# EAGLE design test1 (EAGLE 7.3.0)
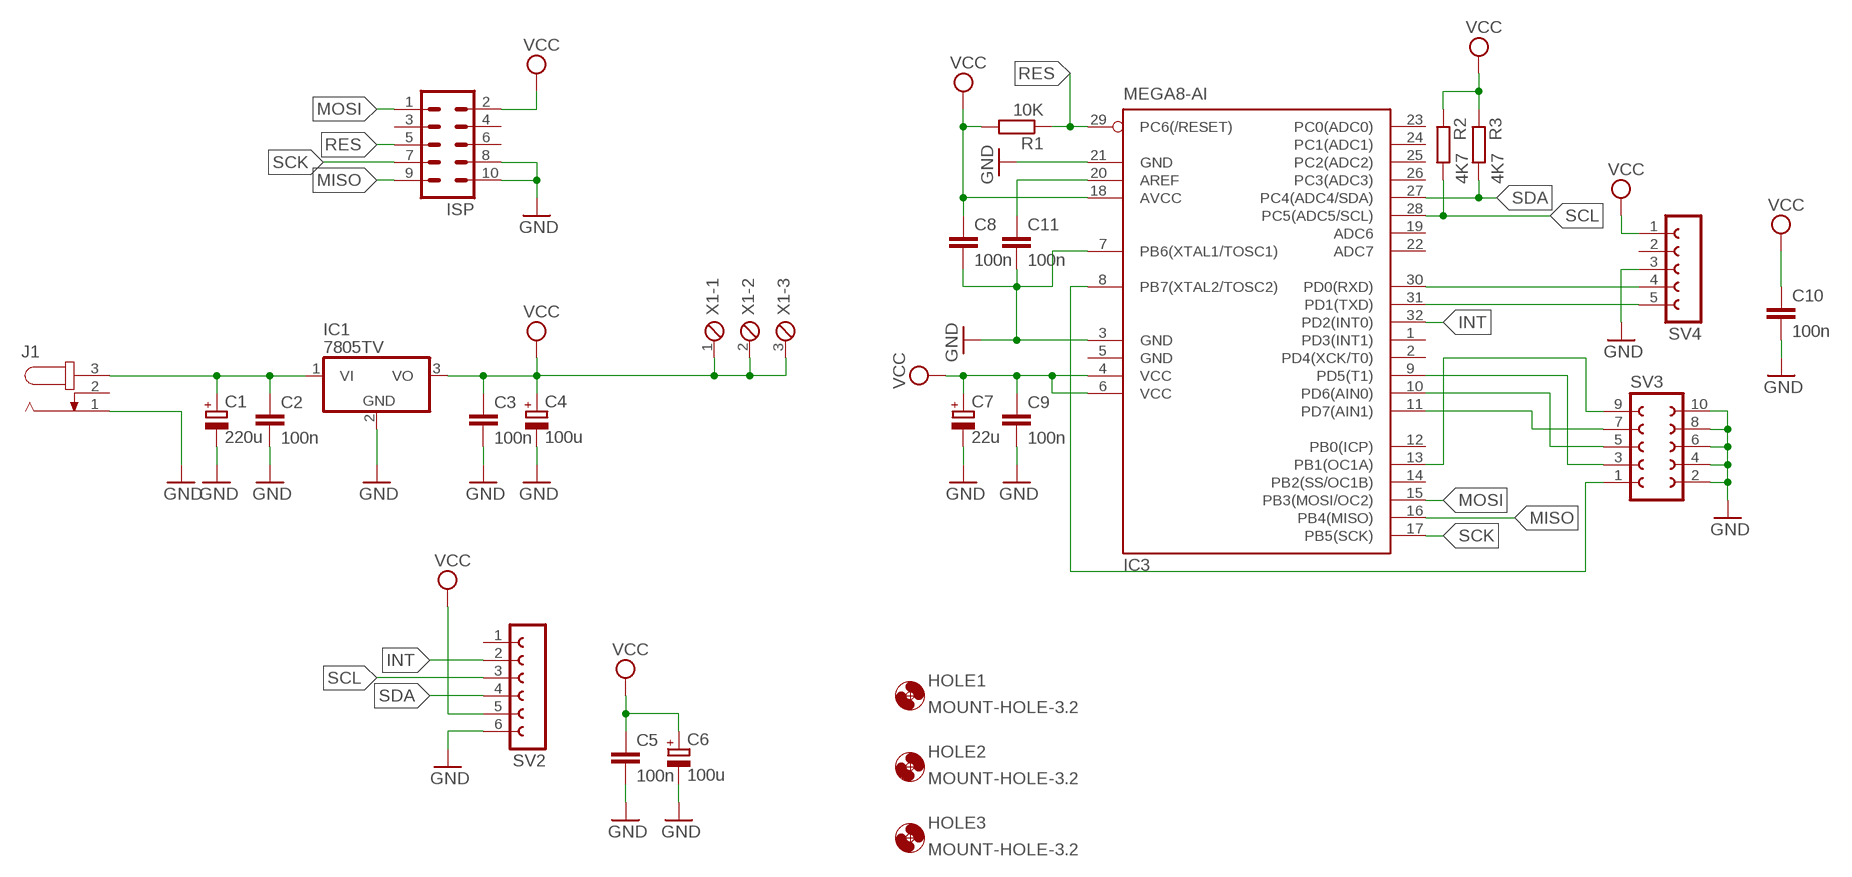
[diagram p0: schematic, sheet 1]

## Parts
C1  220u  CPOL-EUE3.5-8  [E3,5-8]
C2  100n  C-EUC0805  [C0805]
C3  100n  C-EUC0805  [C0805]
C4  100u  CPOL-EUE2.5-5  [E2,5-5]
C5  100n  C-EUC0805  [C0805]
C6  100u  CPOL-EUE2.5-5  [E2,5-5]
C7  22u  CPOL-EUE2.5-5  [E2,5-5]
C8  100n  C-EUC0805  [C0805]
C9  100n  C-EUC0805  [C0805]
C10  100n  C-EUC0805  [C0805]
C11  100n  C-EUC0805  [C0805]
HOLE1  MOUNT-HOLE-3.2  [3,2]
HOLE2  MOUNT-HOLE-3.2  [3,2]
HOLE3  MOUNT-HOLE-3.2  [3,2]
IC1  7805TV  [TO220V]
IC3  MEGA8-AI  [TQFP32-08]
ISP  ML10  [ML10]
J1  JACK-PLUG1  [SPC4078]
R1  10K  R-EU_R0805  [R0805]
R2  4K7  R-EU_R0805  [R0805]
R3  4K7  R-EU_R0805  [R0805]
SV2  FE06-1  [FE06]
SV3  FE05-2  [FE05-2]
SV4  FE05-1  [FE05-1]
X1  MPT3  [3POL254]

## Nets
GND: C1.- C2.2 C3.2 C4.- C5.2 C6.- C7.- C8.2 C9.2 C10.2 C11.2 IC1.2(GND) IC3.3(GND) IC3.7(PB6(XTAL1/TOSC1)) IC3.21(GND) ISP.8 ISP.10 J1.1 SV2.6 SV3.2 SV3.4 SV3.6 SV3.8 SV3.10 SV4.3
INT: IC3.32(PD2(INT0)) SV2.2
MISO: IC3.16(PB4(MISO)) ISP.9
MOSI: IC3.15(PB3(MOSI/OC2)) ISP.1
N$1: C1.+ C2.1 IC1.1(VI) J1.3
N$2: C11.1 IC3.20(AREF)
N$4: IC3.30(PD0(RXD)) SV4.4
N$5: IC3.31(PD1(TXD)) SV4.5
N$6: IC3.8(PB7(XTAL2/TOSC2)) SV3.1
N$8: IC3.13(PB1(OC1A)) SV3.9
N$9: IC3.11(PD7(AIN1)) SV3.7
N$10: IC3.10(PD6(AIN0)) SV3.5
N$11: IC3.9(PD5(T1)) SV3.3
RES: IC3.29(PC6(/RESET)) ISP.5 R1.1
SCK: IC3.17(PB5(SCK)) ISP.7
SCL: IC3.28(PC5(ADC5/SCL)) R2.2 SV2.3
SDA: IC3.27(PC4(ADC4/SDA)) R3.2 SV2.4
VCC: C3.1 C4.+ C5.1 C6.+ C7.+ C8.1 C9.1 C10.1 IC1.3(VO) IC3.4(VCC) IC3.6(VCC) IC3.18(AVCC) ISP.2 R1.2 R2.1 R3.1 SV2.5 SV4.1 X1.1 X1.2 X1.3
Unconnected: IC3.1(PD3(INT1)) IC3.2(PD4(XCK/T0)) IC3.12(PB0(ICP)) IC3.14(PB2(SS/OC1B)) IC3.19(ADC6) IC3.22(ADC7) IC3.23(PC0(ADC0)) IC3.24(PC1(ADC1)) IC3.25(PC2(ADC2)) IC3.26(PC3(ADC3)) ISP.3 ISP.4 ISP.6 J1.2 SV2.1 SV4.2

## Power pins joined to a net without a drawn wire
GND: IC3.5(GND)

## Library data of the parts
C1 C4 C6 C7 = rcl:CPOL-EU: POLARIZED CAPACITOR, European symbol
C2 C3 C5 C8-C11 = rcl:C-EU: CAPACITOR, European symbol
HOLE1-HOLE3 = holes:MOUNT-HOLE-: MOUNTING HOLE with drill center marker; BOM: EXCLUDE
IC1 = linear:78*: Positive VOLTAGE REGULATOR Source: http://cache.national.com/ds/LM/LM78L05.pdf http://www.fairchildsemi.com/ds/LM/LM7805.pdf
IC3 = atmel:MEGA8: MICROCONTROLLER 8 Kbytes FLASH, 1 kbytes SRAM, 512 bytes EEPROM, USART, 6-channel 10 bit ADC, 2-channel 8 bit ADC Pin compatible with Atmega48, ATMega88, ATMega168 Source: avr.lbr; MPN: ATMEGA8-16AU; OC_FARNELL: 9171371; OC_NEWARK: 73M8863
ISP = con-harting-ml:ML10: HARTING; OC_FARNELL: unknown; OC_NEWARK: unknown
J1 = con-jack:JACK-PLUG: DC POWER JACK Power Jack, DC, Right Angle, Through Hole, Rated 5A at 16VDC, PC Terminals Distributor: Farnell (www.Farnell.de) Drawing: 84N1161.pdf / 84N1162.pdf Manufacturer: SPC Technology (www.spctechnology.com) Type: SPC4077 / SPC 4078; OC_FARNELL: unknown; OC_NEWARK: unknown
R1-R3 = rcl:R-EU_: RESISTOR, European symbol
SV2 = con-lsta:FE06-1: FEMALE HEADER; OC_FARNELL: unknown; OC_NEWARK: unknown
SV3 = con-lsta:FE05-2: FEMALE HEADER; OC_FARNELL: unknown; OC_NEWARK: unknown
SV4 = con-lsta:FE05-1: FEMALE HEADER; OC_FARNELL: unknown; OC_NEWARK: unknown
X1 = con-phoenix-254:MPT3: PHOENIX CONNECTOR; OC_FARNELL: unknown; OC_NEWARK: unknown

## Board
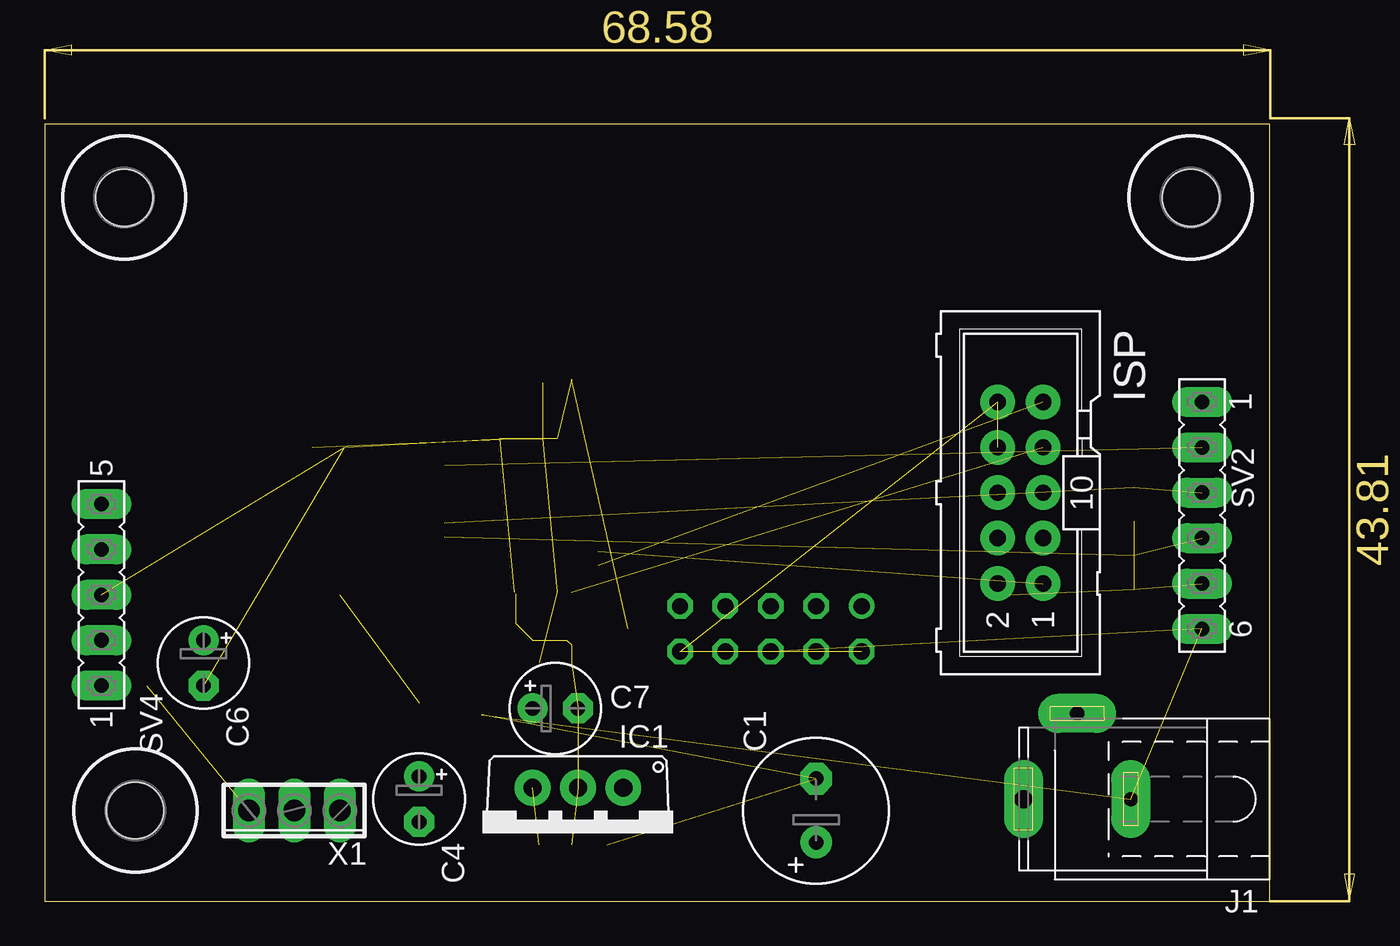
[diagram p1: board, top side]
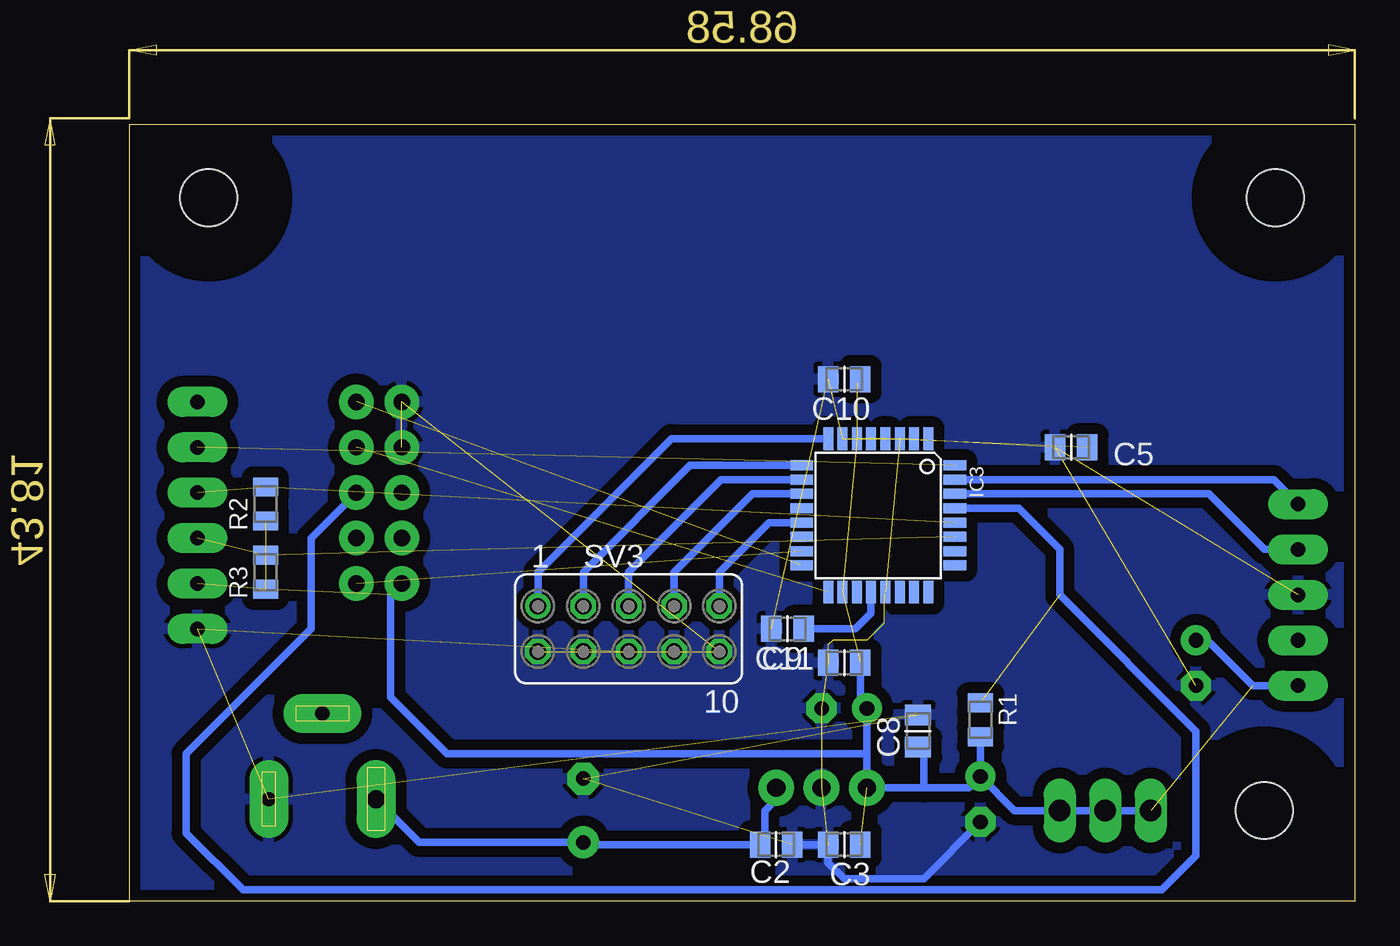
[diagram p2: board, bottom side, seen from below]

Size 68.56 x 43.48 mm. Coordinates in mm from the lower left corner, seen from the top.
Outline: 0,0 68.56,0 68.56,43.48 0,43.48 0,0
Copper layers (1*16): Top 0.035mm / dielectric 1.5mm / Bottom 0.035mm
Design rules "default *": minimum track width 10mil, minimum drill 24mil, track to track 8mil, track to pad 8mil, pad to pad 8mil, via to via 8mil, smd to smd 8mil, copper to edge 4mil, drill to drill 8mil, minimum pad ring 10mil, minimum via ring 8mil, stop-mask expansion 4mil, vias tented up to drill 0mil, thermal gap 10mil

### Footprints (pad centres in the part's own frame; a part is rotated, then mirrored left to right if it is on the bottom)
E3,5-8 = drill 0.813 pad 1.778: + -1.778,0 | drill 0.813 pad 1.778 octagon: - 1.778,0
C0805 = smd 1.15 x 1.45: 1 -0.9,0; 2 0.9,0
E2,5-5 = drill 0.813 pad 1.676: + -1.27,0 | drill 0.813 pad 1.676 octagon: - 1.27,0
3,2 = hole 3.2: 0,0
TO220V = drill 1.016 pad 2: 1 -2.54,-2.54; 2 0,-2.54; 3 2.54,-2.54
TQFP32-08 = smd 1.27 x 0.559: 1 -4.293,2.8; 2 -4.293,2; 3 -4.293,1.2; 4 -4.293,0.4; 5 -4.293,-0.4; 6 -4.293,-1.2; 7 -4.293,-2; 8 -4.293,-2.8; 17 4.293,-2.8; 18 4.293,-2; 19 4.293,-1.2; 20 4.293,-0.4; 21 4.293,0.4; 22 4.293,1.2; 23 4.293,2; 24 4.293,2.8 | smd 0.559 x 1.27: 9 -2.8,-4.293; 10 -2,-4.293; 11 -1.2,-4.293; 12 -0.4,-4.293; 13 0.4,-4.293; 14 1.2,-4.293; 15 2,-4.293; 16 2.8,-4.293; 25 2.8,4.293; 26 2,4.293; 27 1.2,4.293; 28 0.4,4.293; 29 -0.4,4.293; 30 -1.2,4.293; 31 -2,4.293; 32 -2.8,4.293
ML10 = drill 0.914 pad 1.93: 1 -5.08,-1.27; 2 -5.08,1.27; 3 -2.54,-1.27; 4 -2.54,1.27; 5 0,-1.27; 6 0,1.27; 7 2.54,-1.27; 8 2.54,1.27; 9 5.08,-1.27; 10 5.08,1.27
SPC4078 = drill 0.8 pad 2.184 long: 1 -3,0; 2 0,-4.8 | drill 1 pad 2.184 long: 3 3,0
R0805 = smd 1.05 x 1.4: 1 -0.95,0; 2 0.95,0
FE06 = drill 0.813 pad 1.676 long: 1 -6.35,0; 2 -3.81,0; 3 -1.27,0; 4 1.27,0; 5 3.81,0; 6 6.35,0
FE05-2 = drill 0.914: 1 -5.08,1.27 | drill 0.914 octagon: 2 -5.08,-1.27; 3 -2.54,1.27; 4 -2.54,-1.27; 5 0,1.27; 6 0,-1.27; 7 2.54,1.27; 8 2.54,-1.27; 9 5.08,1.27; 10 5.08,-1.27
FE05-1 = drill 0.813 pad 1.676 long: 1 -5.08,0; 2 -2.54,0; 3 0,0; 4 2.54,0; 5 5.08,0
3POL254 = drill 1.2 long: 1 -2.54,0; 2 0,0; 3 2.54,0

### Placement (x,y rotation side)
C1  43.18,5.08 90 top
C2  32.38,3.17 0 bottom
C3  28.57,3.17 180 bottom
C4  20.95,5.71 270 top
C5  15.88,25.4 180 bottom
C6  8.89,13.34 270 top
C7  28.57,10.79 0 top
C8  24.45,9.53 90 bottom
C9  28.57,13.34 180 bottom
C10  28.57,29.21 180 bottom
C11  31.75,15.24 180 bottom
HOLE1  5.08,5.08 0 top
HOLE2  64.14,39.37 0 top
HOLE3  4.45,39.37 0 top
IC1  29.84,3.81 180 top
IC3  26.67,21.59 270 bottom
ISP  54.61,22.86 90 top
J1  57.78,5.71 180 top
R1  20.95,10.16 270 bottom
R2  60.96,22.23 90 bottom
R3  60.96,18.41 90 bottom
SV2  64.77,21.59 270 top
SV3  40.64,15.24 0 bottom
SV4  3.17,17.14 90 top
X1  13.97,5.08 180 top

### Tracks (layer width: path | path; a pad name or v marks a point on that pad's centre or on a via)
GND  (27 unrouted)
  Bottom 0.406: C4.- 24.13,1.27 28.57,1.27 29.48,2.17 C3.2 C2.2 | IC3.21 26.35,17.21
  pour Bottom (isolate 0.61): 0,43.81 68.58,43.81 68.58,0 0,0
INT  (1 unrouted)
MISO  (1 unrouted)
MOSI  (1 unrouted)
N$1
  Bottom 0.406: J1.3 52.37,3.3 C1.+ 43.05,3.17 C2.1 33.02,3.44 33.02,5.08 32.38,5.71 IC1.1
N$2
  Bottom 0.406: C11.1 27.94,15.24 27.07,16.11 IC3.20
N$4
  Bottom 0.406: SV4.4 5.08,19.68 8.19,22.79 IC3.30
N$5
  Bottom 0.406: SV4.5 4.54,23.59 IC3.31
N$6
  Bottom 0.406: SV3.1 45.72,18.41 38.25,25.88 IC3.8
N$8
  Bottom 0.406: SV3.9 35.56,18.41 32.78,21.19 IC3.13
N$9
  Bottom 0.406: SV3.7 38.1,18.41 33.73,22.79 IC3.11
N$10
  Bottom 0.406: SV3.5 40.64,18.41 35.47,23.59 IC3.10
N$11
  Bottom 0.406: SV3.3 43.18,18.41 37.2,24.39 IC3.9
RES  (1 unrouted)
  Bottom 0.406: ISP.5 58.42,20.32 58.42,15.24 65.41,8.26 65.41,3.81 62.23,0.64 10.79,0.64 8.89,2.54 8.89,9.53 16.51,17.14 16.51,19.68 18.82,21.99 IC3.29
SCK  (1 unrouted)
SCL  (2 unrouted)
SDA  (2 unrouted)
VCC  (10 unrouted)
  Bottom 0.406: C4.+ 21.59,6.35 24.13,6.35 | 24.13,6.35 IC1.3 27.3,8.26 | C4.+ 19.05,5.08 X1.1 X1.2 X1.3 | R1.2 C4.+ | 27.3,8.26 C7.+ 27.68,11.16 C9.1 | SV4.1 5.71,12.06 8.26,14.61 C6.+ | C8.1 24.13,8.31 24.13,6.35 | ISP.2 53.98,17.14 53.98,11.43 50.8,8.26 27.3,8.26 | C10.1 27.87,29.02